# EAGLE schematic KW2CPU.PCB (EAGLE 6.5.0)
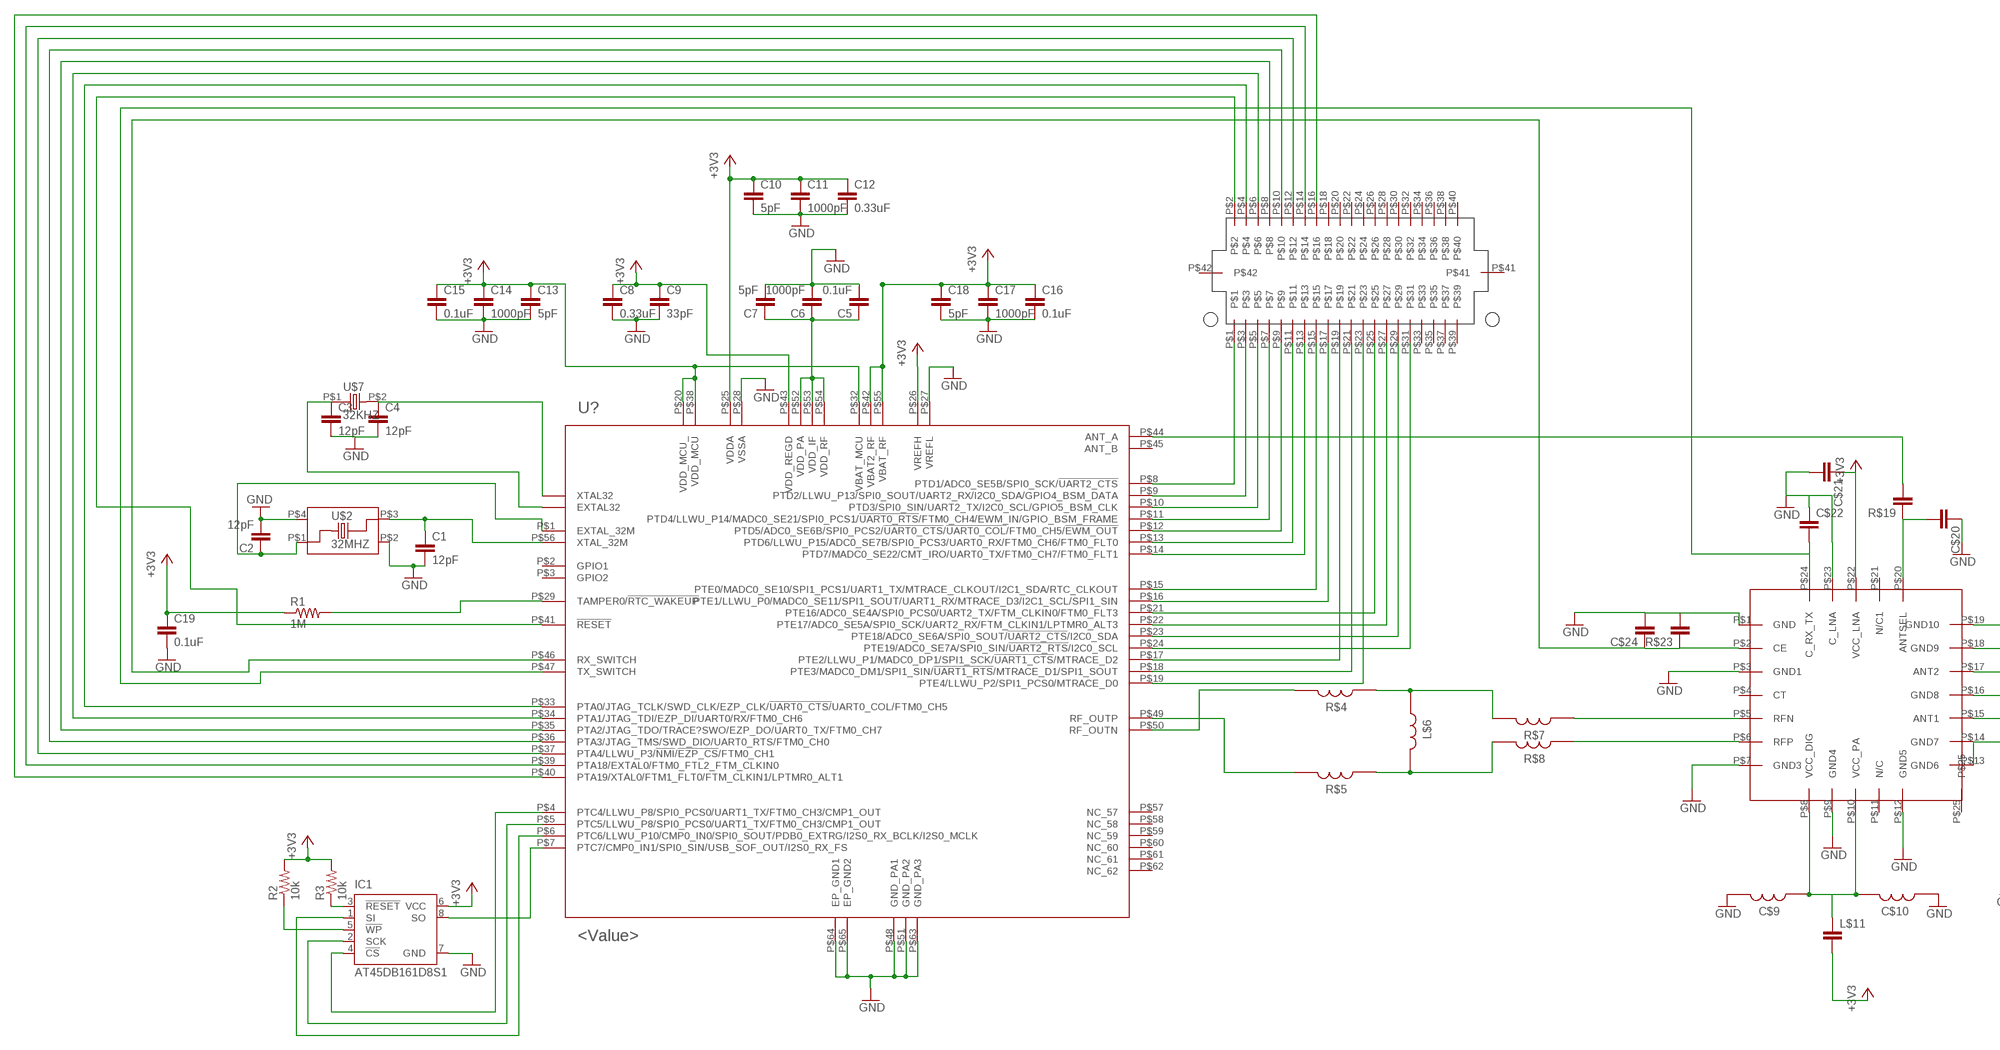
[diagram p0: schematic, sheet 1, part 1 of 2]
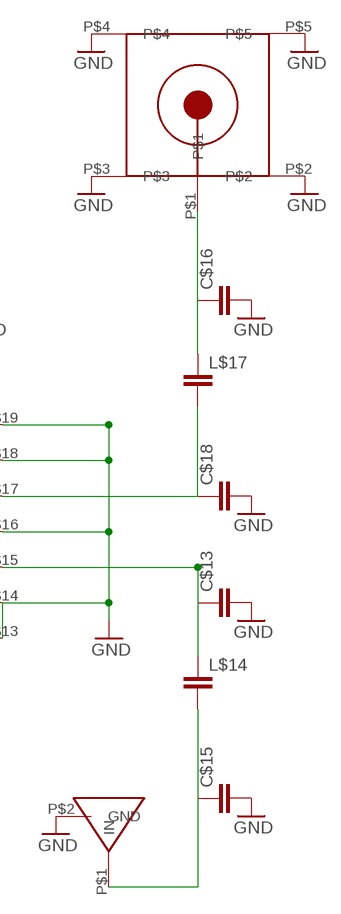
[diagram p1: schematic, sheet 1, part 2 of 2]

## Parts
C1  12pF  RF-C0402  [C0402]
C2  12pF  RF-C0402  [C0402]
C3  12pF  RF-C0402  [C0402]
C4  12pF  RF-C0402  [C0402]
C5  0.1uF  RF-C0402  [C0402]
C6  1000pF  RF-C0402  [C0402]
C7  5pF  RF-C0402  [C0402]
C8  0.33uF  RF-C0402  [C0402]
C9  33pF  RF-C0402  [C0402]
C10  5pF  RF-C0402  [C0402]
C11  1000pF  RF-C0402  [C0402]
C12  0.33uF  RF-C0402  [C0402]
C13  5pF  RF-C0402  [C0402]
C14  1000pF  RF-C0402  [C0402]
C15  0.1uF  RF-C0402  [C0402]
C16  0.1uF  RF-C0402  [C0402]
C17  1000pF  RF-C0402  [C0402]
C18  5pF  RF-C0402  [C0402]
C19  0.1uF  RF-C0402  [C0402]
C$9  RF-L  [RF-L0201]
C$10  RF-L  [RF-L0201]
C$13  RF-C  [RFMD0402]
C$15  RF-C  [RFMD0402]
C$16  RF-C  [RFMD0402]
C$18  RF-C  [RFMD0402]
C$20  RF-C  [RFMD0402]
C$21  RF-C  [RFMD0402]
C$22  RF-C  [RFMD0402]
C$24  RF-C  [RFMD0402]
IC1  AT45DB161D8S1  [8S1]
L$6  RF-L  [RF-L0201]
L$11  RF-C  [RFMD0402]
L$14  RF-C  [RFMD0402]
L$17  RF-C  [RFMD0402]
R1  1M  RF-R0402  [RF-R0402]
R2  10k  RF-R0402  [RF-R0402]
R3  10k  RF-R0402  [RF-R0402]
R$4  RF-L  [RF-L0201]
R$5  RF-L  [RF-L0201]
R$7  RF-L  [RF-L0201]
R$8  RF-L  [RF-L0201]
R$19  RF-C  [RFMD0402]
R$23  RF-C  [RFMD0402]
U$1  MKW21D  [LGA63]
U$2  32MHZ  [32MHZSMD]
U$3  RF6555  [RF6555]
U$4  F-ANTENNA  [F_ANT_RFMD]
U$5  MMCX_VERT  [MMCX_VERT]
U$6  DF12_M  [DF12_M]
U$7  32KHZ  [32KHZSMD]

## Nets
+3V3: C8.1 C9.1 C10.1 C11.1 C12.1 C13.1 C14.1 C15.1 C16.1 C17.1 C18.1 C19.1 C$21.P$1 IC1.6(VCC) L$11.P$2 R1.1 R2.2 R3.2 U$1.P$20(VDD_MCU_) U$1.P$25(VDDA) U$1.P$26(VREFH) U$1.P$32(VBAT_MCU) U$1.P$38(VDD_MCU) U$1.P$42(VBAT2_RF) U$1.P$43(VDD_REGD) U$1.P$55(VBAT_RF) U$3.P$22(VCC_LNA)
CLKM1: C1.1 U$1.P$56(XTAL_32M) U$2.P$3
CLKM2: C2.1 U$1.P$1(EXTAL_32M) U$2.P$1
GND: C1.2 C2.2 C3.2 C4.2 C5.2 C6.2 C7.2 C8.2 C9.2 C10.2 C11.2 C12.2 C13.2 C14.2 C15.2 C16.2 C17.2 C18.2 C19.2 C$9.P$1 C$10.P$2 C$13.P$2 C$15.P$2 C$16.P$2 C$18.P$2 C$20.P$1 C$21.P$2 C$22.P$1 C$24.P$2 IC1.7(GND) U$1.P$27(VREFL) U$1.P$28(VSSA) U$1.P$48(GND_PA1) U$1.P$51(GND_PA2) U$1.P$63(GND_PA3) U$1.P$64(EP_GND1) U$1.P$65(EP_GND2) U$2.P$2 U$2.P$4 U$3.P$1(GND) U$3.P$3(GND1) U$3.P$7(GND3) U$3.P$9(GND4) U$3.P$12(GND5) U$3.P$13(GND6) U$3.P$14(GND7) U$3.P$16(GND8) U$3.P$18(GND9) U$3.P$19(GND10) U$3.P$23(C_LNA) U$4.P$2(GND) U$5.P$2 U$5.P$3 U$5.P$4 U$5.P$5
N$1: R1.2 U$1.P$29(TAMPER0/!RTC_WAKEUP)
N$2: R$5.P$1 U$1.P$49(RF_OUTP)
N$3: R$4.P$1 U$1.P$50(RF_OUTN)
N$4: L$6.P$2 R$4.P$2 R$7.P$1
N$5: L$6.P$1 R$5.P$2 R$8.P$1
N$6: C5.1 C6.1 C7.1 U$1.P$52(VDD_PA) U$1.P$53(VDD_IF) U$1.P$54(VDD_RF)
N$7: IC1.4(!CS) U$1.P$4(PTC4/LLWU_P8/SPI0_PCS0/UART1_TX/FTM0_CH3/CMP1_OUT)
N$8: IC1.3(!RESET) R3.1
N$9: IC1.5(!WP) R2.1
N$10: U$1.P$33(PTA0/JTAG_TCLK/SWD_CLK/EZP_CLK/!UART0_CTS/!UART0_COL/FTM0_CH5) U$6.P$4
N$11: U$1.P$34(PTA1/JTAG_TDI/EZP_DI/UART0/RX/FTM0_CH6) U$6.P$6
N$12: U$1.P$35(PTA2/JTAG_TDO/TRACE?SWO/EZP_DO/UART0_TX/FTM0_CH7) U$6.P$8
N$13: U$1.P$36(PTA3/JTAG_TMS/SWD_DIO/UART0_RTS/FTM0_CH0) U$6.P$10
N$14: U$1.P$41(!RESET) U$6.P$2
N$15: U$1.P$37(PTA4/LLWU_P3/!NMI!/!EZP_CS!/FTM0_CH1) U$6.P$12
N$16: IC1.2(SCK) U$1.P$5(PTC5/LLWU_P8/SPI0_PCS0/UART1_TX/FTM0_CH3/CMP1_OUT)
N$17: IC1.1(SI) U$1.P$6(PTC6/LLWU_P10/CMP0_IN0/SPI0_SOUT/PDB0_EXTRG/I2S0_RX_BCLK/I2S0_MCLK)
N$18: IC1.8(SO) U$1.P$7(PTC7/CMP0_IN1/SPI0_SIN/USB_SOF_OUT/I2S0_RX_FS)
N$19: R$7.P$2 U$3.P$5(RFN)
N$20: R$8.P$2 U$3.P$6(RFP)
N$21: C$13.P$1 L$14.P$1 U$3.P$15(ANT1)
N$22: C$9.P$2 C$10.P$1 L$11.P$1 U$3.P$8(VCC_DIG) U$3.P$10(VCC_PA)
N$23: C$15.P$1 L$14.P$2 U$4.P$1(IN)
N$24: C$18.P$1 L$17.P$2 U$3.P$17(ANT2)
N$25: C$16.P$1 L$17.P$1 U$5.P$1
N$26: R$19.P$2 U$1.P$44(ANT_A)
N$27: C$20.P$2 R$19.P$1 U$3.P$20(ANTSEL)
N$28: C3.1 U$1.P$31(EXTAL32) U$7.P$1
N$30: C$24.P$1 R$23.P$1 U$1.P$46(RX_SWITCH) U$3.P$2(CE)
N$31: C$22.P$2 U$1.P$47(TX_SWITCH) U$3.P$24(C_RX_TX)
N$32: C4.1 U$1.P$30(XTAL32) U$7.P$2
N$33: U$1.P$9(PTD2/LLWU_P13/SPI0_SOUT/UART2_RX/I2C0_SDA/GPIO4_BSM_DATA) U$6.P$3
N$34: U$1.P$8(PTD1/ADC0_SE5B/SPI0_SCK/!UART2_CTS) U$6.P$1
N$35: U$1.P$10(PTD3/SPI0_SIN/UART2_TX/I2C0_SCL/GPIO5_BSM_CLK) U$6.P$5
N$36: U$1.P$11(PTD4/LLWU_P14/MADC0_SE21/SPI0_PCS1/!UART0_RTS!/FTM0_CH4/EWM_IN/GPIO_BSM_FRAME) U$6.P$7
N$37: U$1.P$12(PTD5/ADC0_SE6B/SPI0_PCS2/!UART0_CTS!/!UART0_COL!/FTM0_CH5/!EWM_OUT) U$6.P$9
N$38: U$1.P$13(PTD6/LLWU_P15/ADC0_SE7B/SPI0_PCS3/UART0_RX/FTM0_CH6/FTM0_FLT0) U$6.P$11
N$39: U$1.P$14(PTD7/MADC0_SE22/CMT_IRO/UART0_TX/FTM0_CH7/FTM0_FLT1) U$6.P$13
N$40: U$1.P$15(PTE0/MADC0_SE10/SPI1_PCS1/UART1_TX/MTRACE_CLKOUT/I2C1_SDA/RTC_CLKOUT) U$6.P$15
N$41: U$1.P$16(PTE1/LLWU_P0/MADC0_SE11/SPI1_SOUT/UART1_RX/MTRACE_D3/I2C1_SCL/SPI1_SIN) U$6.P$17
N$42: U$1.P$17(PTE2/LLWU_P1/MADC0_DP1/SPI1_SCK/!UART1_CTS!/MTRACE_D2) U$6.P$19
N$43: U$1.P$18(PTE3/MADC0_DM1/SPI1_SIN/!UART1_RTS!/MTRACE_D1/SPI1_SOUT) U$6.P$21
N$44: U$1.P$19(PTE4/LLWU_P2/SPI1_PCS0/MTRACE_D0) U$6.P$23
N$45: U$1.P$21(PTE16/ADC0_SE4A/SPI0_PCS0/UART2_TX/FTM_CLKIN0/FTM0_FLT3) U$6.P$25
N$46: U$1.P$22(PTE17/ADC0_SE5A/SPI0_SCK/UART2_RX/FTM_CLKIN1/LPTMR0_ALT3) U$6.P$27
N$47: U$1.P$23(PTE18/ADC0_SE6A/SPI0_SOUT/!UART2_CTS!/I2C0_SDA) U$6.P$29
N$48: U$1.P$24(PTE19/ADC0_SE7A/SPI0_SIN/!UART2_RTS!/I2C0_SCL) U$6.P$31
N$49: U$1.P$39(PTA18/EXTAL0/FTM0_FTL2_FTM_CLKIN0) U$6.P$14
N$50: U$1.P$40(PTA19/XTAL0/FTM1_FLT0/FTM_CLKIN1/LPTMR0_ALT1) U$6.P$16
Unconnected: R$23.P$2 U$1.P$2(GPIO1) U$1.P$3(GPIO2) U$1.P$45(ANT_B) U$1.P$57(NC_57) U$1.P$58(NC_58) U$1.P$59(NC_59) U$1.P$60(NC_60) U$1.P$61(NC_61) U$1.P$62(NC_62) U$3.P$4(CT) U$3.P$11(N/C) U$3.P$21(N/C1) U$3.P$25 U$6.P$18 U$6.P$20 U$6.P$22 U$6.P$24 U$6.P$26 U$6.P$28 U$6.P$30 U$6.P$32 U$6.P$33 U$6.P$34 U$6.P$35 U$6.P$36 U$6.P$37 U$6.P$38 U$6.P$39 U$6.P$40 U$6.P$41 U$6.P$42

## Library data of the parts
C1-C19 C$13 C$15 C$16 C$18 C$20-C$22 C$24 L$11 L$14 L$17 R$19 R$23 = GW-devices:RF-C: RF capacitor pads for FSL reference design
C$9 C$10 L$6 R$4 R$5 R$7 R$8 = GW-devices:RF-L: RF inductor pads for FSL reference design
IC1 = KW2:AT45DB161D: 16-megabit 2.5V or 2.7V DataFlash Source: http://www.atmel.com/dyn/resources/prod_documents/doc3500.pdf
R1-R3 = GW-devices:RF-R: RF resistor pads for FSL reference design
U$1 = ZIGBEE:MKW21D: Freescale's new Kinetis KW20 wireless MCUs expands on the successful Kinetis MCU family based on the ARM® Cortex™-M4 CPU core. The Kinetis KW20 Wireless MCU integrates a class-leading RF transceiver, Cortex™-M4 and a robust feature set for reliable, secure, and low-power IEEE® 802.15.4 wireless solutions. Product Summary Page: http://www.freescale.com/webapp/sps/site/prod_summary.jsp?code=KW20 Datasheet: http://cache.freescale.com/files/rf_if/doc/data_sheet/MKW22D512V.pdf
U$2 = KW2:32MHZ: 32Mhz crystal for KW2 radio; MFGN: NDK; MFGP: EXS00A-CS02368
U$3 = KW2:RF6555
U$4 = KW2:F-ANTENNA: PCB-base F-Antenna
U$5 = KW2:MMCX_VERT
U$6 = KW2:DF12_M
U$7 = KW2:32KHZ